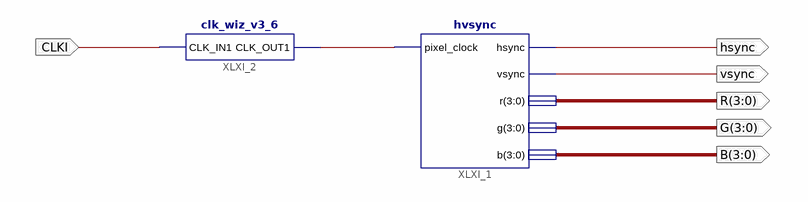
[diagram p0: schematic sheet 1]
// Xilinx ISE schematic main.sch (spartan6) as structural Verilog: 2 symbols, 6 ports
module main (
  input  CLKI,
  output hsync,
  output vsync,
  output [3:0] R,
  output [3:0] G,
  output [3:0] B
);

  wire XLXN_1;

  hvsync XLXI_1 (.pixel_clock(XLXN_1), .hsync(hsync), .vsync(vsync), .r(R), .g(G), .b(B));
  clk_wiz_v3_6 XLXI_2 (.CLK_IN1(CLKI), .CLK_OUT1(XLXN_1));
endmodule
